# Altium schematic sheet MotorCellOne.SchDoc: ODRIVE-FOC
size A3; DocumentNumber: SEASKY; Revision: V1.1
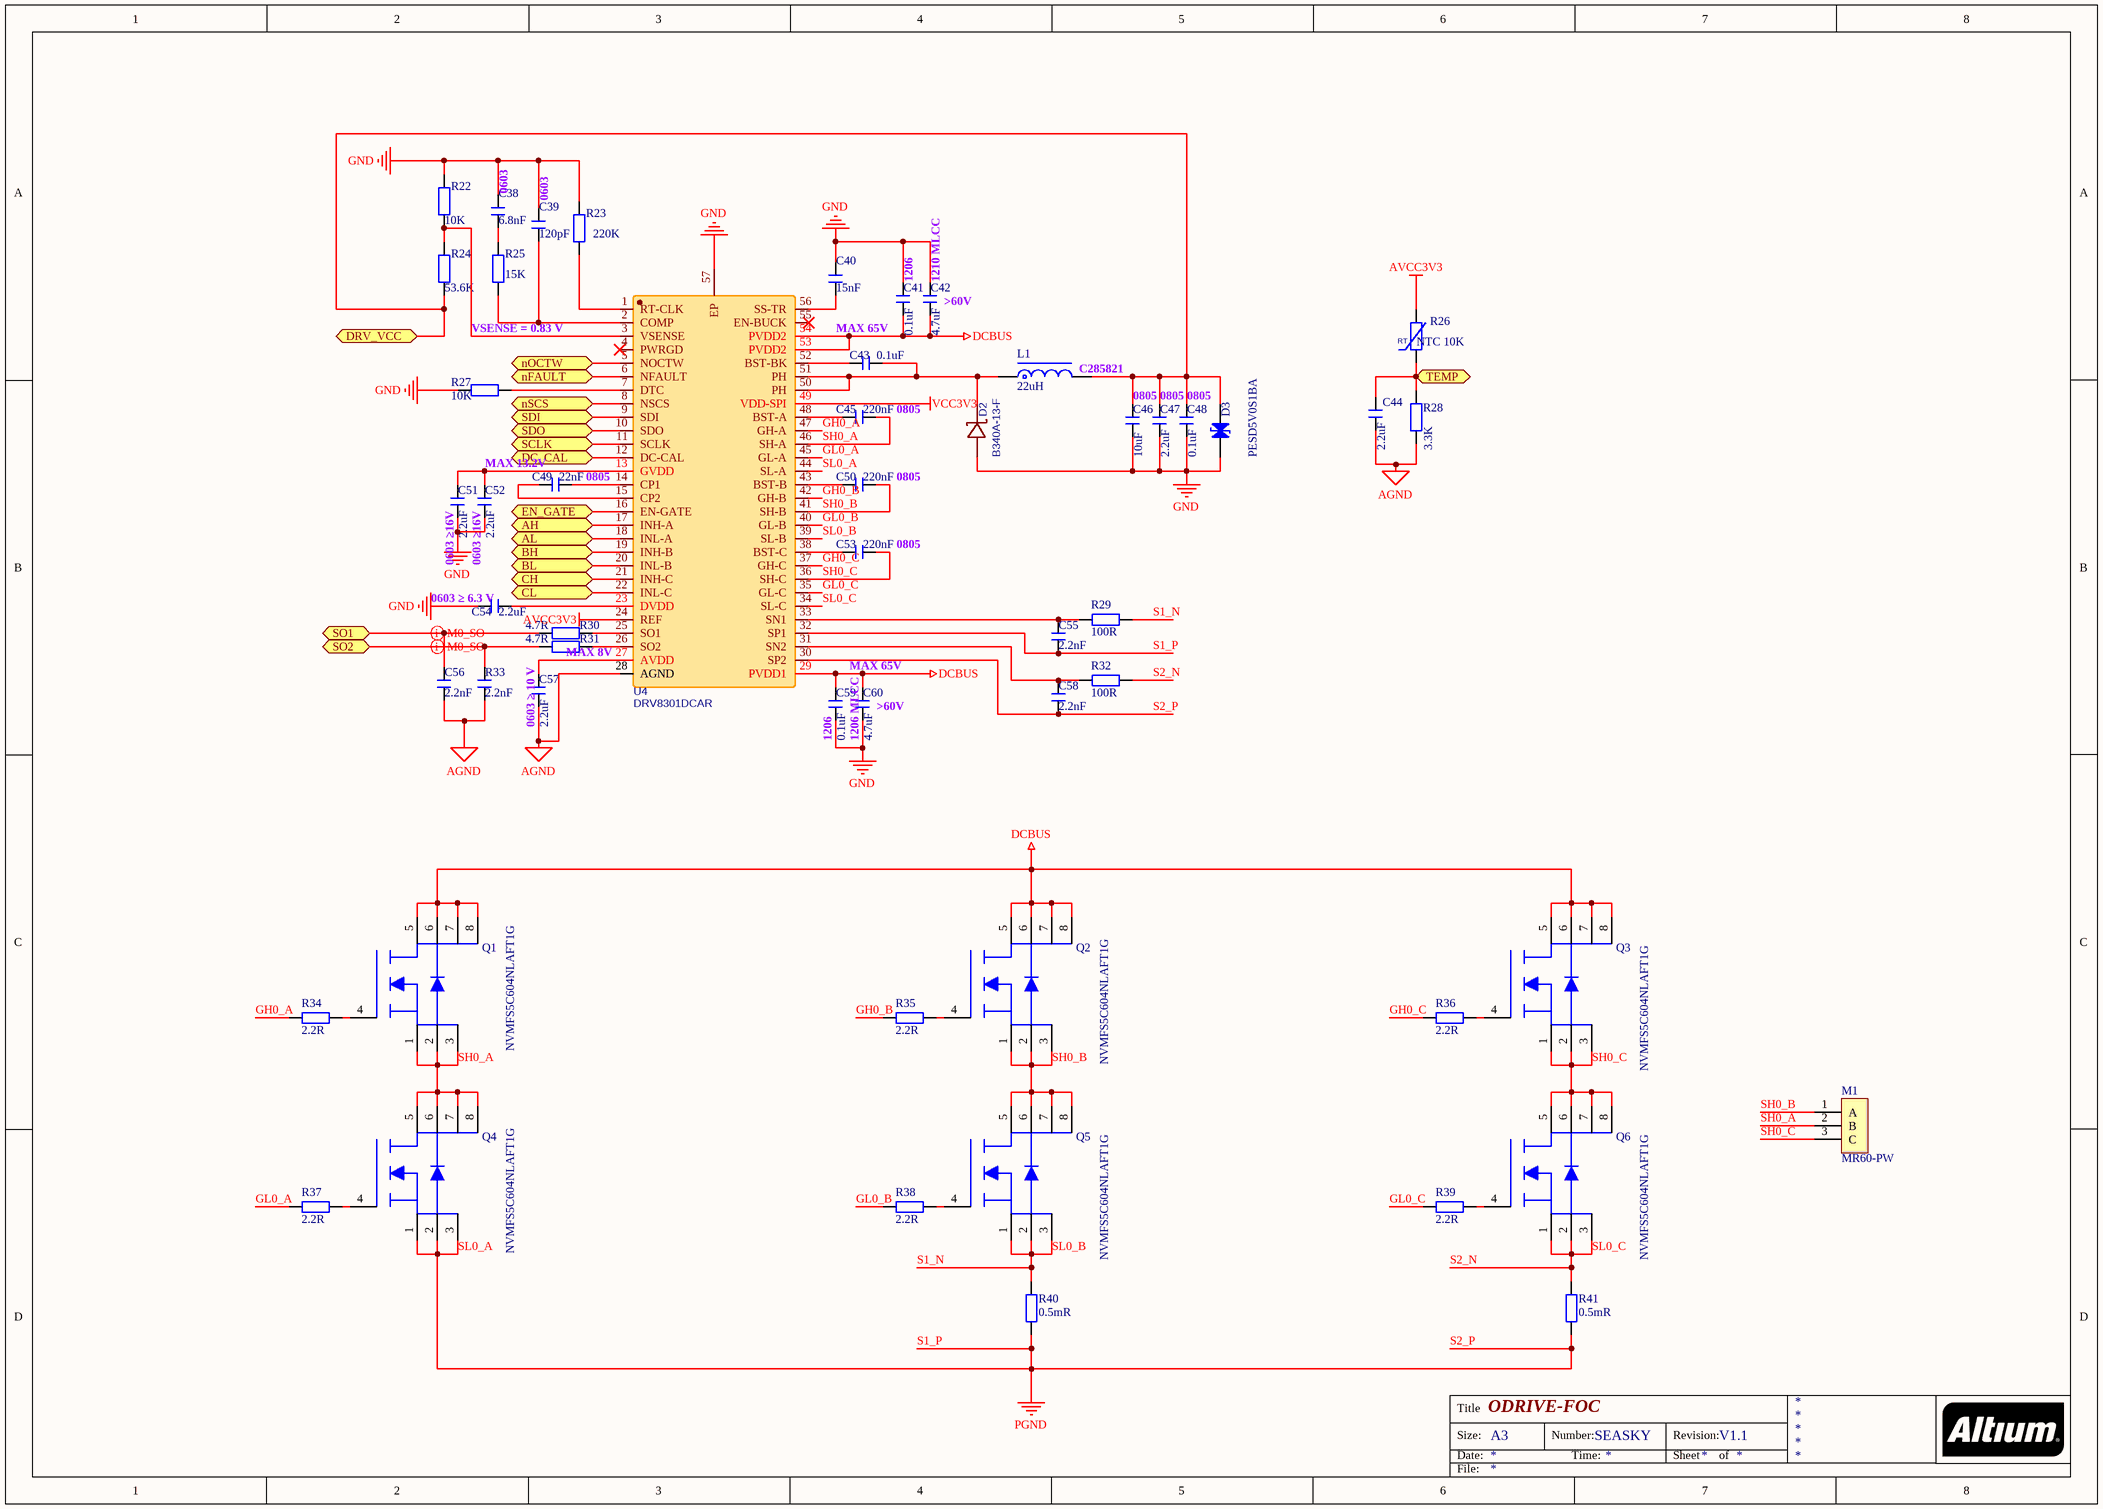
[diagram p0: MotorCellOne.SchDoc]

## Parts
C38  6.8nF  [C 0603_L]
C39  120pF  [C 0603_L]
C40  15nF  [C 0603_L]
C41  0.1uF  [C 1206_L]
C42  4.7uF  [C 1210_L]
C43  0.1uF  [C 0603_L]
C44  2.2uF  [C 0603_L]
C45  220nF  [C 0805_L]
C46  10uF  [C 0805_L]
C47  2.2uF  [C 0805_L]
C48  0.1uF  [C 0805_L]
C49  22nF  [C 0805_L]
C50  220nF  [C 0805_L]
C51  2.2uF  [C 0603_L]
C52  2.2uF  [C 0603_L]
C53  220nF  [C 0805_L]
C54  2.2uF  [C 0603_L]
C55  2.2nF  [C 0603_L]
C56  2.2nF  [C 0603_L]
C57  2.2uF  [C 0603_L]
C58  2.2nF  [C 0603_L]
C59  0.1uF  [C 1206_L]
C60  4.7uF  [C 1210_L]
D2  B340A-13-F  [SMA_L4.4-W2.6-LS5.0-RD]
D3  PESD5V0S1BA  [SOD-323]
L1  22uH  [CD53]
M1  MR60-PW  [MR30-PW]
Q1  NVMFS5C604NLAFT1G  [PG-TDSON-8_L5.0-W6.0-P1.27-LS6.2-BL-EP]
Q2  NVMFS5C604NLAFT1G  [PG-TDSON-8_L5.0-W6.0-P1.27-LS6.2-BL-EP]
Q3  NVMFS5C604NLAFT1G  [PG-TDSON-8_L5.0-W6.0-P1.27-LS6.2-BL-EP]
Q4  NVMFS5C604NLAFT1G  [PG-TDSON-8_L5.0-W6.0-P1.27-LS6.2-BL-EP]
Q5  NVMFS5C604NLAFT1G  [PG-TDSON-8_L5.0-W6.0-P1.27-LS6.2-BL-EP]
Q6  NVMFS5C604NLAFT1G  [PG-TDSON-8_L5.0-W6.0-P1.27-LS6.2-BL-EP]
R22  10K  [R 0603_L]
R23  220K  [R 0603_L]
R24  53.6K  [R 0603_L]
R25  15K  [R 0603_L]
R26  NTC 10K  [R 0805-HP_L]
R27  10K  [R 0603_L]
R28  3.3K  [R 0805_L]
R29  100R  [R 0603_L]
R30  4.7R  [R 0603_L]
R31  4.7R  [R 0603_L]
R32  100R  [R 0603_L]
R33  2.2nF  [C 0603_L]
R34  2.2R  [R 0603_L]
R35  2.2R  [R 0603_L]
R36  2.2R  [R 0603_L]
R37  2.2R  [R 0603_L]
R38  2.2R  [R 0603_L]
R39  2.2R  [R 0603_L]
R40  0.5mR  [R3920]
R41  0.5mR  [R3920]
U4  DRV8301DCAR  [HTSSOP-56_L14.0-W6.0-P0.50-LS8.0-BL]

## Ports
AH (bidir), AL (bidir), BH (bidir), BL (bidir), CH (bidir), CL (bidir), DC_CAL (bidir), DRV_VCC (bidir), EN_GATE (bidir), nFAULT (bidir), nOCTW (bidir), nSCS (bidir), SCLK (bidir), SDI (bidir), SDO (bidir), SO1 (bidir), SO2 (bidir), TEMP (bidir)

## Nets
AGND: C44.2 C56.1 C57.1 R28.1 R33.1 U4.28(AGND)
AVCC3V3: R26.2 U4.24(REF)
DCBUS: C41.1 C42.1 C59.2 C60.2 Q1.5 Q1.6 Q1.7 Q1.8 Q2.5 Q2.6 Q2.7 Q2.8 Q3.5 Q3.6 Q3.7 Q3.8 U4.29(PVDD1) U4.53(PVDD2) U4.54(PVDD2)
GND: C38.1 C39.1 C40.1 C41.2 C42.2 C46.1 C47.1 C48.1 C51.1 C52.1 C54.1 C59.1 C60.1 D2.2(A) D3.2(K) R22.2 R23.2 R27.2 U4.57(EP)
S1_P: C55.1 C58.1 Q4.1 Q4.2 Q4.3 R40.1 R41.1 U4.30(SP2) U4.32(SP1) U4.44(SL-A)  [also labelled PGND, S2_P, SL0_A]
VCC3V3: U4.49(VDD-SPI)
AH: U4.17(INH-A) ; port AH
AL: U4.18(INL-A) ; port AL
BH: U4.19(INH-B) ; port BH
BL: U4.20(INL-B) ; port BL
CH: U4.21(INH-C) ; port CH
CL: U4.22(INL-C) ; port CL
DC_CAL: U4.12(DC-CAL) ; port DC_CAL
DRV_VCC: C46.2 C47.2 C48.2 D3.1(A) L1.2 R24.1 ; port DRV_VCC
EN_GATE: U4.16(EN-GATE) ; port EN_GATE
GH0_A: R34.1 U4.47(GH-A)
GH0_B: R35.1 U4.42(GH-B)
GH0_C: R36.1 U4.37(GH-C)
GL0_A: R37.1 U4.45(GL-A)
GL0_B: R38.1 U4.40(GL-B)
GL0_C: R39.1 U4.35(GL-C)
nFAULT: U4.6(NFAULT) ; port nFAULT
nOCTW: U4.5(NOCTW) ; port nOCTW
nSCS: U4.8(NSCS) ; port nSCS
S1_N: Q5.1 Q5.2 Q5.3 R29.2 R40.2 U4.39(SL-B)  [also labelled SL0_B]
S2_N: Q6.1 Q6.2 Q6.3 R32.2 R41.2 U4.34(SL-C)  [also labelled SL0_C]
SCLK: U4.11(SCLK) ; port SCLK
SDI: U4.9(SDI) ; port SDI
SDO: U4.10(SDO) ; port SDO
SH0_A: C45.2 M1.2(B) Q1.1 Q1.2 Q1.3 Q4.5 Q4.6 Q4.7 Q4.8 U4.46(SH-A)
SH0_B: C50.2 M1.1(A) Q2.1 Q2.2 Q2.3 Q5.5 Q5.6 Q5.7 Q5.8 U4.41(SH-B)
SH0_C: C53.2 M1.3(C) Q3.1 Q3.2 Q3.3 Q6.5 Q6.6 Q6.7 Q6.8 U4.36(SH-C)
SO1: C56.2 R30.1 ; port SO1
SO2: R31.1 R33.2 ; port SO2
TEMP: C44.1 R26.1 R28.2 ; port TEMP
NetC38_2: C38.2 R25.2
NetC39_2: C39.2 R25.1 U4.2(COMP)
NetC40_2: C40.2 U4.56(SS-TR)
NetC43_1: C43.1 D2.1(K) L1.1 U4.50(PH) U4.51(PH)
NetC43_2: C43.2 U4.52(BST-BK)
NetC45_1: C45.1 U4.48(BST-A)
NetC49_1: C49.1 U4.14(CP1)
NetC49_2: C49.2 U4.15(CP2)
NetC50_1: C50.1 U4.43(BST-B)
NetC51_2: C51.2 C52.2 U4.13(GVDD)
NetC53_1: C53.1 U4.38(BST-C)
NetC54_2: C54.2 U4.23(DVDD)
NetC55_2: C55.2 R29.1 U4.33(SN1)
NetC57_2: C57.2 U4.27(AVDD)
NetC58_2: C58.2 R32.1 U4.31(SN2)
NetQ1_4: Q1.4 R34.2
NetQ2_4: Q2.4 R35.2
NetQ3_4: Q3.4 R36.2
NetQ4_4: Q4.4 R37.2
NetQ5_4: Q5.4 R38.2
NetQ6_4: Q6.4 R39.2
NetR22_1: R22.1 R24.2 U4.3(VSENSE)
NetR23_1: R23.1 U4.1(RT-CLK)
NetR27_1: R27.1 U4.7(DTC)
NetR30_2: R30.2 U4.25(SO1)
NetR31_2: R31.2 U4.26(SO2)

Not connected (* = marked no-connect by the designer): U4 4(PWRGD)* 55(EN-BUCK)*

## Layout directives
differential pair: SO1, SO2

## Notes on the sheet
- (near C38) 0603
- 0603
- 1206
- (near C42) >60V
- (near C42) 1210 MLCC
- VSENSE = 0.83 V
- MAX 65V
- (near L1) C285821
- 0805
- MAX 13.2V
- (near C50) 0805
- (near C51) 0603 ≥16V
- (near C52) 0603 ≥16V
- (near C53) 0805
- (near C54) 0603 ≥ 6.3 V
- (near C57) 0603 ≥ 10 V
- (near R31) MAX 8V
- (near C60) >60V
- (near C59) 1206
- (near C60) 1206 MLCC
- Title
- Size:
- Date:
- A3
- Number:
- Time:
- Revision:
- Sheet
- of
- File:

## Library data of the parts
C38-C60 R33 = C: 贴片电容
D2 = B340A-13-F: BOM_Manufacturer: DIODES; SMT Type: Extend; BOM_Supplier: LCSC; BOM_Manufacturer Part: B340A-13-F; BOM_Supplier Part: C85098; BOM_JLCPCB SMD: Yes; spicePre: D; spiceSymbolName: B340A-13-F
D3 = PESD5V0S1BA: PESD5V0S1BA、ESD二极管、5V
L1 = L-SMD: CD系列贴片线绕功率电感
Q1-Q6 = BSC037N08NS5ATMA1
R22-R25 R27-R32 R34-R39 = R: 贴片电阻
R26 = RT: 热敏电阻
R40 R41 = R-Precision: 精密贴片电阻
U4 = DRV8301DCAR: BOM_Manufacturer: Texas Instruments; Contributor: LCSC; SMT Type: Extend; BOM_Supplier: LCSC; BOM_Supplier Part: C98969; BOM_Manufacturer Part: DRV8301DCAR; BOM_JLCPCB SMD: Yes; spicePre: U; spiceSymbolName: DRV8301DCAR